# Altium schematic sheet conditioning_circuit.SchDoc
size A4; Date: 12.11.2024; Author: Mikolaj Pichita; SheetNumber: 1; SheetTotal: 1
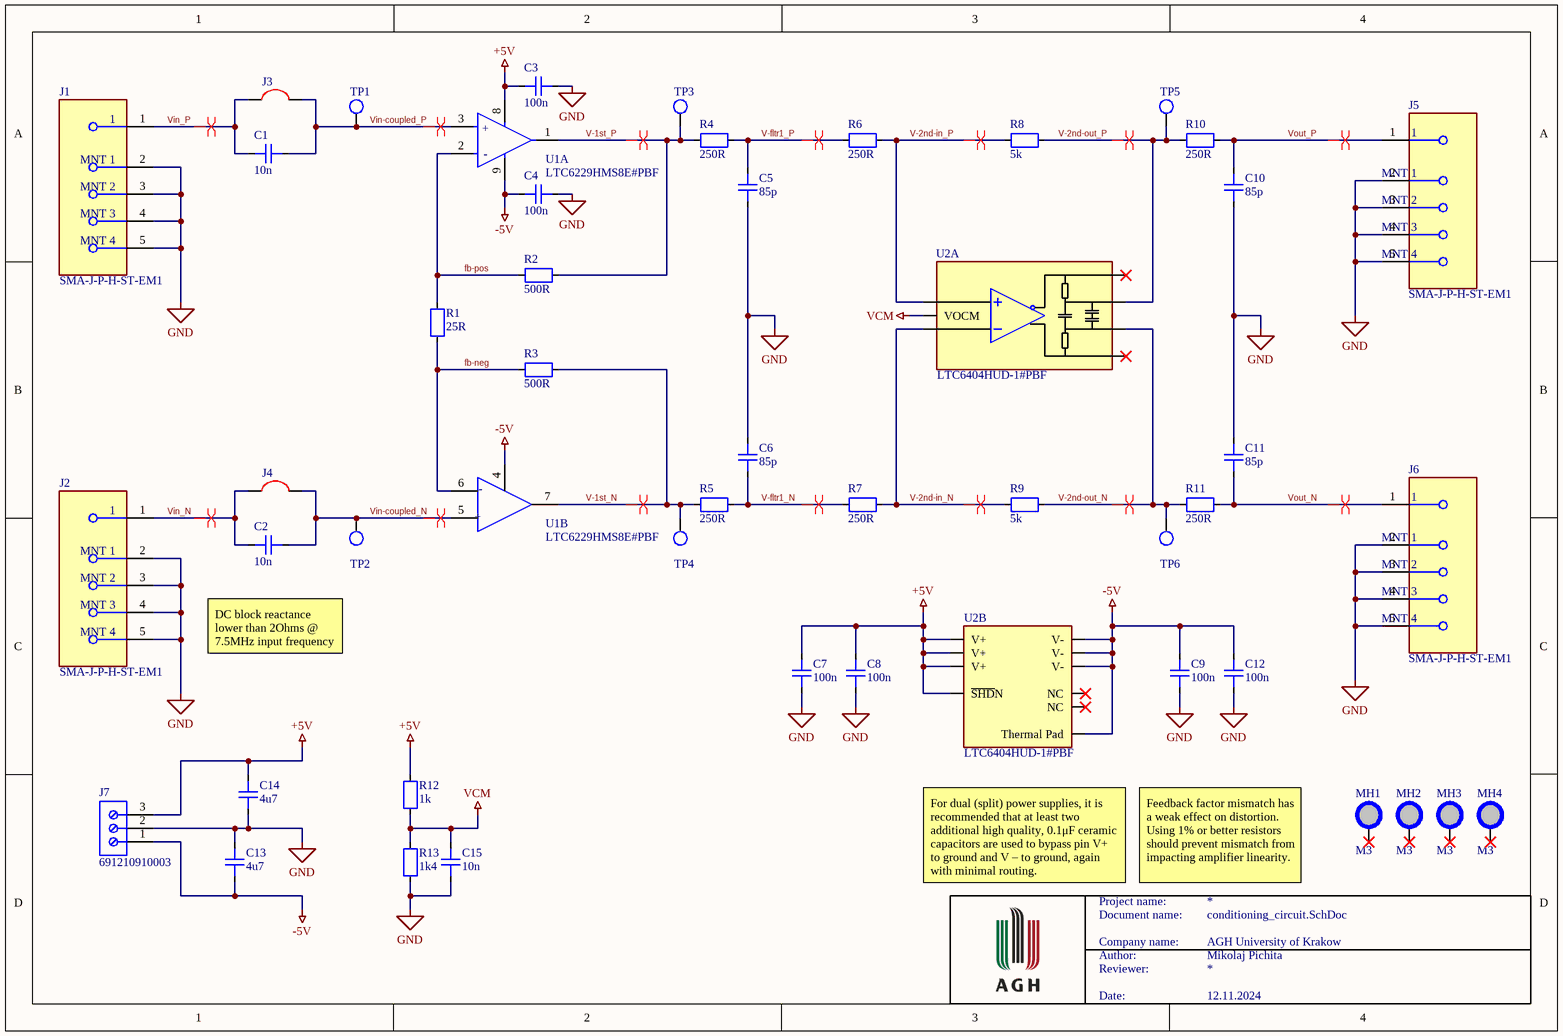
[diagram p0: conditioning_circuit.SchDoc]

## Parts
C1  10n  [CAP0603]
C2  10n  [CAP0603]
C3  100n  [CAP0603]
C4  100n  [CAP0603]
C5  85p  [CAP0603]
C6  85p  [CAP0603]
C7  100n  [CAP0603]
C8  100n  [CAP0603]
C9  100n  [CAP0603]
C10  85p  [CAP0603]
C11  85p  [CAP0603]
C12  100n  [CAP0603]
C13  4u7  [CAP0603]
C14  4u7  [CAP0603]
C15  10n  [CAP0603]
J1  SMA-J-P-H-ST-EM1  [FP-SMA-J-P-H-ST-EM1-MFG]
J2  SMA-J-P-H-ST-EM1  [FP-SMA-J-P-H-ST-EM1-MFG]
J3  *  [JUMPER]  (value not drawn)
J4  *  [JUMPER]  (value not drawn)
J5  SMA-J-P-H-ST-EM1  [FP-SMA-J-P-H-ST-EM1-MFG]
J6  SMA-J-P-H-ST-EM1  [FP-SMA-J-P-H-ST-EM1-MFG]
J7  691210910003  [691210910003]
MH1  M3  [MountingHole]  (no BOM)
MH2  M3  [MountingHole]  (no BOM)
MH3  M3  [MountingHole]  (no BOM)
MH4  M3  [MountingHole]  (no BOM)
R1  25R  [RES0603]
R2  500R  [RES0603]
R3  500R  [RES0603]
R4  250R  [RES0603]
R5  250R  [RES0603]
R6  250R  [RES0603]
R7  250R  [RES0603]
R8  5k  [RES0603]
R9  5k  [RES0603]
R10  250R  [RES0603]
R11  250R  [RES0603]
R12  1k  [RES0603]
R13  1k4  [RES0603]
TP1  Testpoint  [SMD_TESTPOINT]  (value not drawn)  (no BOM)
TP2  Testpoint  [SMD_TESTPOINT]  (value not drawn)  (no BOM)
TP3  Testpoint  [SMD_TESTPOINT]  (value not drawn)  (no BOM)
TP4  Testpoint  [SMD_TESTPOINT]  (value not drawn)  (no BOM)
TP5  Testpoint  [SMD_TESTPOINT]  (value not drawn)  (no BOM)
TP6  Testpoint  [SMD_TESTPOINT]  (value not drawn)  (no BOM)
U1  LTC6229HMS8E#PBF  [FP-MS8E-8-05-08-1662-IPC_C]  (parts A,B of 2)
U2  LTC6404HUD-1#PBF  [LT-UD-16_M]  (parts A,B of 2)

## Nets
+5V: C3.1 C7.1 C8.1 C14.1 J7.3 R12.2 U1.8(V+) U2.1(~{SHD}N) U2.2(V+) U2.10(V+) U2.11(V+)
-5V: C4.1 C9.1 C12.1 C13.2 J7.1 U1.4(V-) U1.9(V-) U2.3(V-) U2.9(V-) U2.12(V-) U2.17(Thermal_Pad)
GND: C3.2 C4.2 C5.1 C6.1 C7.2 C8.2 C9.2 C10.1 C11.1 C12.2 C13.1 C14.2 C15.2 J1.2(MNT_1) J1.3(MNT_2) J1.4(MNT_3) J1.5(MNT_4) J2.2(MNT_1) J2.3(MNT_2) J2.4(MNT_3) J2.5(MNT_4) J5.2(MNT_1) J5.3(MNT_2) J5.4(MNT_3) J5.5(MNT_4) J6.2(MNT_1) J6.3(MNT_2) J6.4(MNT_3) J6.5(MNT_4) J7.2 R13.1
VCM: C15.1 R12.1 R13.2 U2.4(VOCM)
fb-neg: R1.2 R3.1 U1.6(-INB)
fb-pos: R1.1 R2.1 U1.2(-IN_A)
V-1st_N: R3.2 R5.2 TP4.1 U1.7(OUTB)
V-1st_P: R2.2 R4.1 TP3.1 U1.1(OUTA)
V-2nd-in_N: R7.1 R9.1 U2.6(IN-)
V-2nd-in_P: R6.2 R8.1 U2.15(IN+)
V-2nd-out_N: R9.2 R11.2 TP6.1 U2.7(OUT+)
V-2nd-out_P: R8.2 R10.1 TP5.1 U2.14(OUT-)
V-fltr1_N: C6.2 R5.1 R7.2
V-fltr1_P: C5.2 R4.2 R6.1
Vin-coupled_N: C2.2 J4.2 TP2.1 U1.5(+INB)
Vin-coupled_P: C1.2 J3.2 TP1.1 U1.3(+IN_A)
Vin_N: C2.1 J2.1 J4.1
Vin_P: C1.1 J1.1 J3.1
Vout_N: C11.2 J6.1 R11.1
Vout_P: C10.2 J5.1 R10.2

Not connected (* = marked no-connect by the designer): MH1 1*; MH2 1*; MH3 1*; MH4 1*; U2 5(NC)* 8(OUTF+)* 13(OUTF-)* 16(NC)*

## Layout directives
differential pair: V-1st_N, V-1st_P, V-2nd-in_N, V-2nd-in_P, V-2nd-out_N, V-2nd-out_P, V-fltr1_N, V-fltr1_P, Vin-coupled_N, Vin-coupled_P, Vin_N, Vin_P, Vout_N, Vout_P

## Notes on the sheet
- DC block reactance lower than 2Ohms @ 7.5MHz input frequency
- For dual (split) power supplies, it is recommended that at least two additional high quality, 0.1μF ceramic capacitors are used to bypass pin V+ to ground and V – to ground, again with minimal routing.
- Feedback factor mismatch has a weak effect on distortion. Using 1% or better resistors should prevent mismatch from impacting amplifier linearity.
- Project name:
- Document name:
- Company name:
- Author:
- Reviewer:
- AGH University of Krakow
- Date:
- (in symbol CMP-09116-000250-1, part A) +; -
- (in symbol CMP-09116-000250-1, part B) -; +

## Library data of the parts
C1-C15 = Capacitor: Value: *; HelpURL: *; MPN: *; Supplier: *; SupplierPartNumber: *
J1 J2 J5 J6 = CMP-02754-000006-1: CONN SMA JACK STR 50OHM EDGE MNT; Dielectric Material: PTFE; Center Contact Plating: Gold; Max Frequency: 6GHz; Body Material: Brass; Voltage Rating: 335V; Impedance: 50R; Package Quantity: 1; Case/Package: SMA; Max Operating Temperature: 125°C; Fastening Type: Threaded; Orientation: Straight; Depth: 13.33mm; RoHS Compliant: Yes; Length: 6.35mm; Insulation Material: Polytetrafluoroethylene; Termination: Solder; Min Operating Temperature: -65°C; Housing Color: Gold; Contact Plating: Gold; Contact Material: Copper; Connector Type: SMA; Mount: Edge; Series: SMA; Packaging: Tray; Body Plating: Gold; Radiation Hardening: No
J3 J4 = Jumper: Value: *; HelpURL: *; MPN: *; Supplier: *; SupplierPartNumber: *
J7 = CMP-1502-02457-2: NexarPartId: 105950650
MH1-MH4 = Mounting hole: Value: *; HelpURL: *; MPN: *; Supplier: *; SupplierPartNumber: *
R1-R13 = Resistor: Value: *; HelpURL: *; MPN: *; Supplier: *; SupplierPartNumber: *
TP1-TP6 = SMD_testpoint: Value: *; HelpURL: *; MPN: *; Supplier: *; SupplierPartNumber: *
U1 = CMP-09116-000250-1: IC OPAMP GP 1 CIRCUIT 8MSOP; RoHS Compliant: Yes
U2 = LTC6404HUD-1#PBF: High Speed Operational Amplifiers 600MHz, L N, Hi Prec Fully Diff In/Out A; Value: *; HelpURL: *; MPN: *; Supplier: *; SupplierPartNumber: *